# EasyEDA schematic 6502Attempt1.json
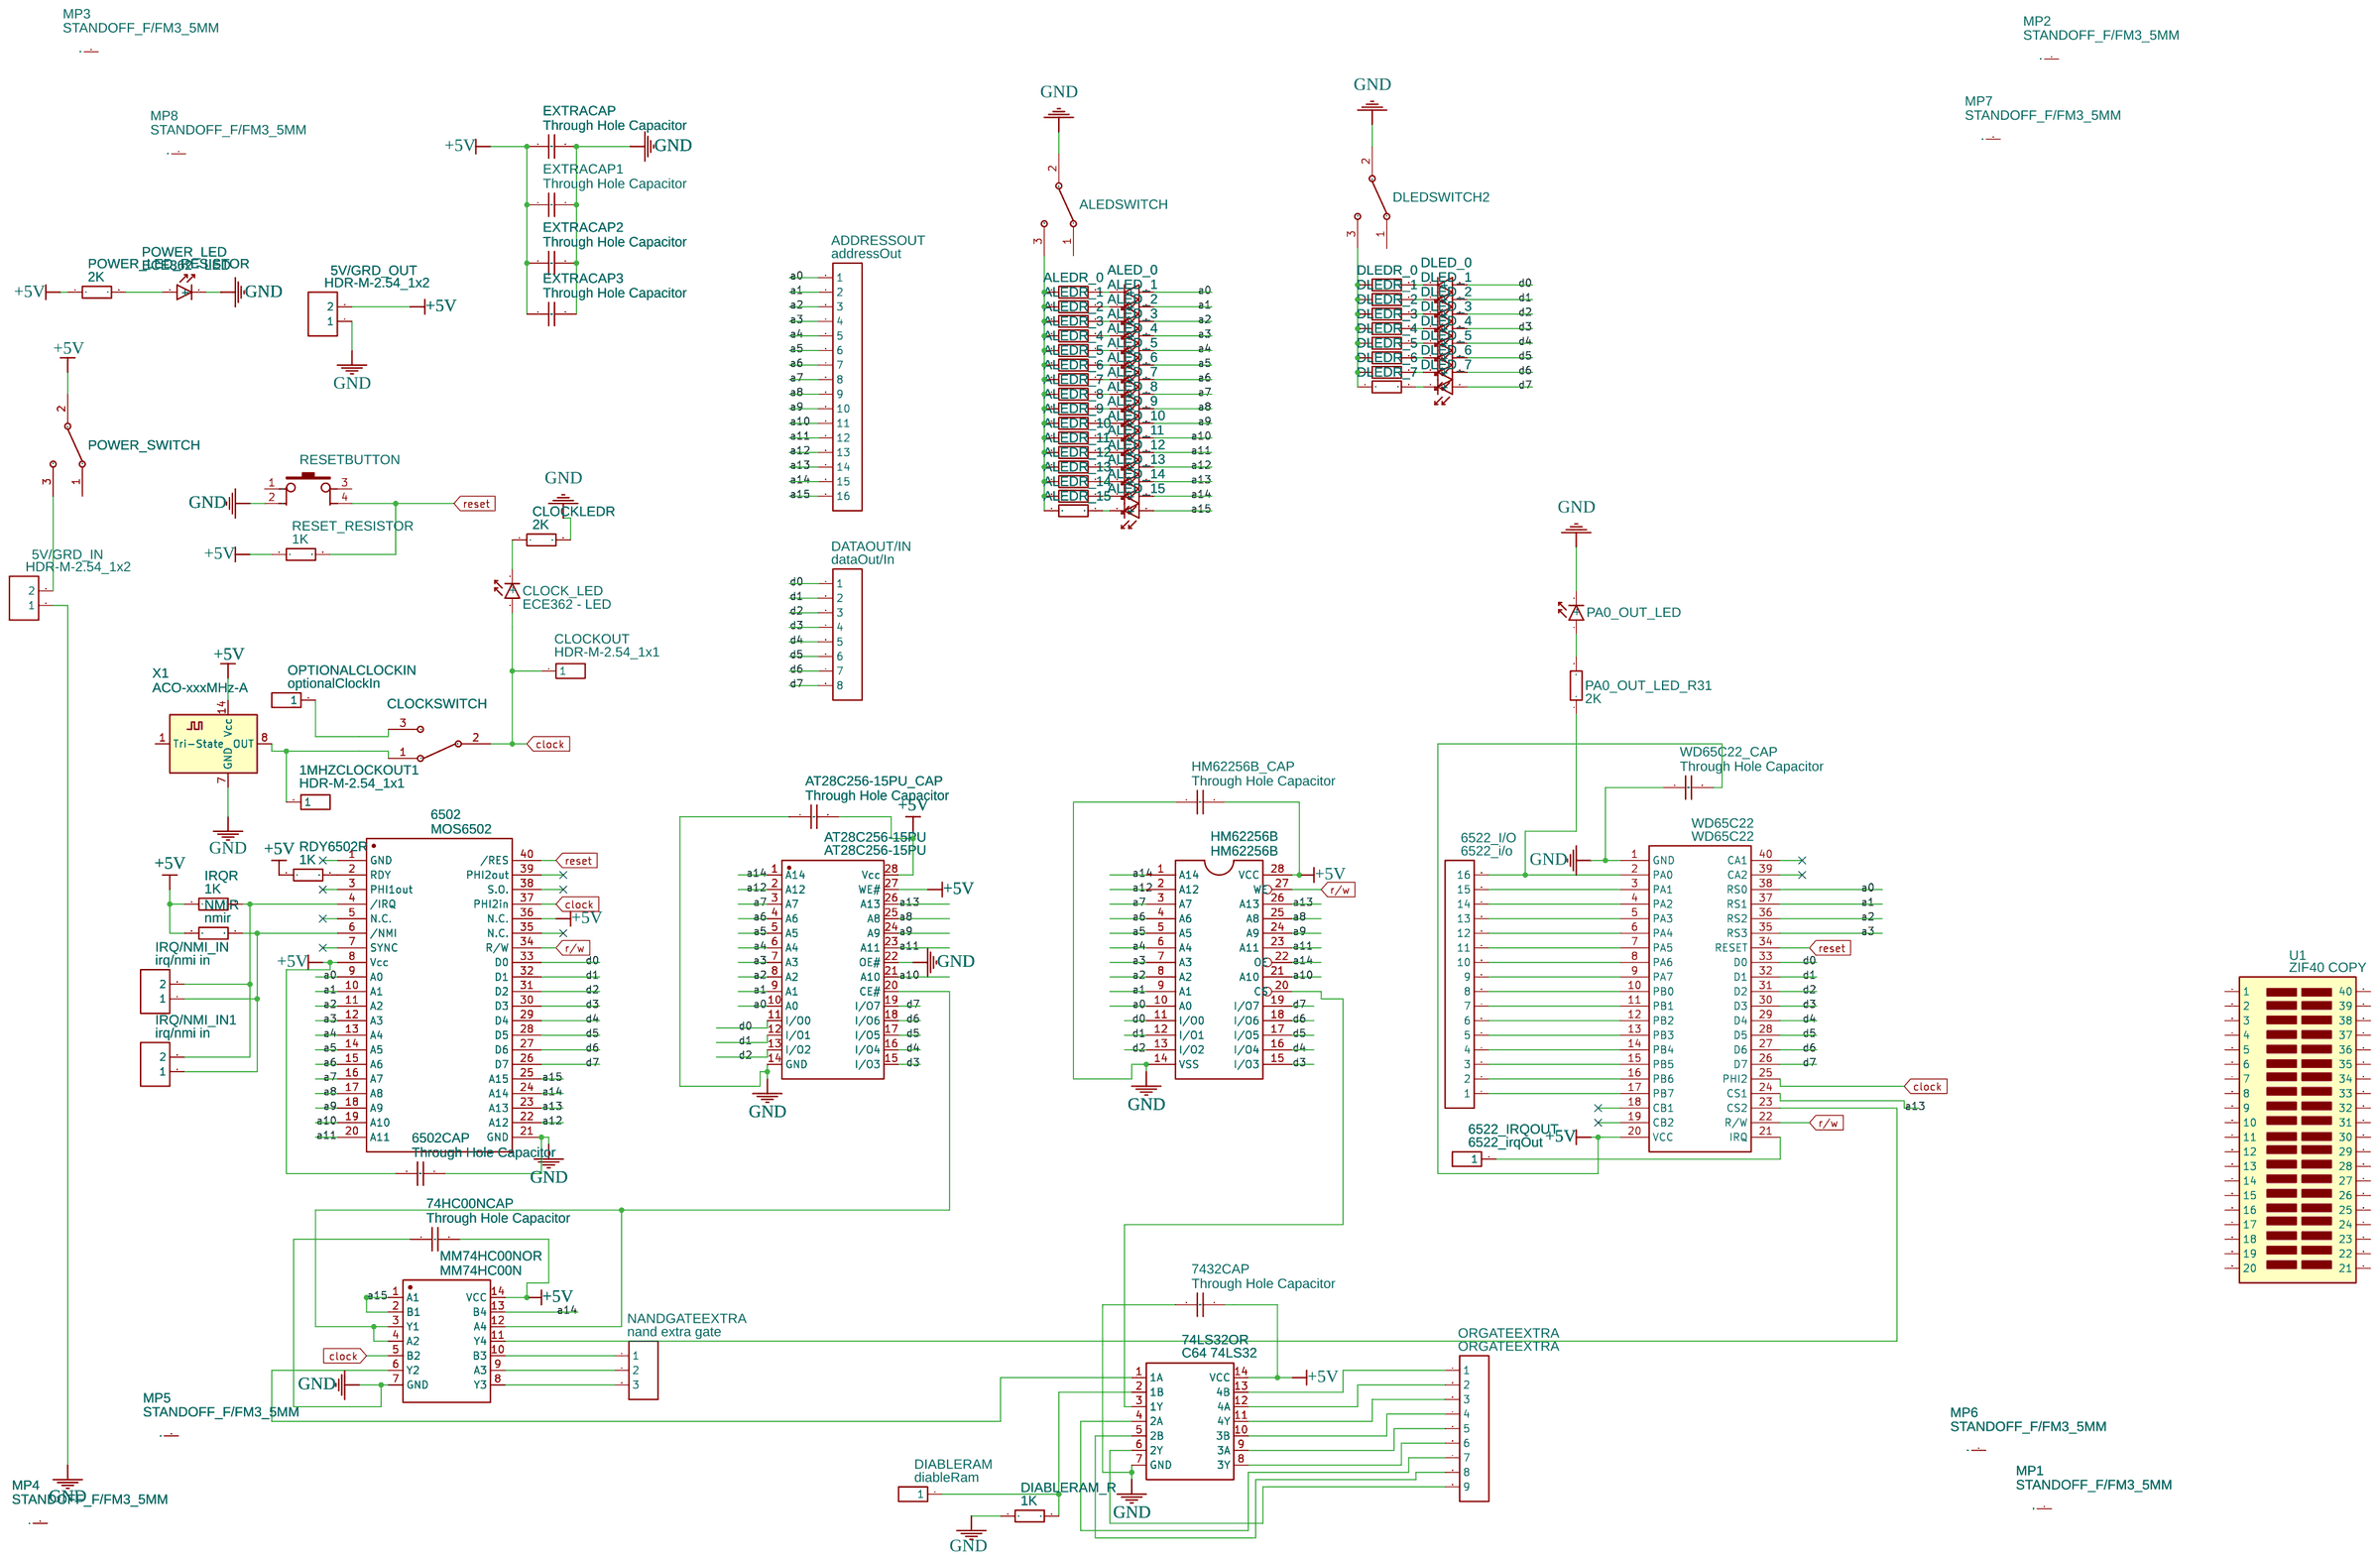
[diagram p0: schematic sheet]

## Parts
1MHZCLOCKOUT1  HDR-M-2.54_1x1  [HDR-M-2.54_1X1]
5V/GRD_IN  HDR-M-2.54_1x2  [HDR-M-2.54_1X2]
5V/GRD_OUT  HDR-M-2.54_1x2  [HDR-M-2.54_1X2]
74HC00NCAP  Through Hole Capacitor  [THROUGH HOLE TANTALUM CAPACITOR]
74LS32OR  C64 74LS32  [C64 74LS32]
6502  MOS6502  [DIP40]
6502CAP  Through Hole Capacitor  [THROUGH HOLE TANTALUM CAPACITOR]
6522_I/O  6522_i/o  [HDR-M-2.54_1X16]
6522_IRQOUT  6522_irqOut  [HDR-M-2.54_1X1]
7432CAP  Through Hole Capacitor  [THROUGH HOLE TANTALUM CAPACITOR]
ADDRESSOUT  addressOut  [HDR-M-2.54_1X16]
ALED_0  ECE362 - LED  [LED-3MM-2.54MM-THROUGH HOLE-FIXED]
ALED_1  ECE362 - LED  [LED-3MM-2.54MM-THROUGH HOLE-FIXED]
ALED_2  ECE362 - LED  [LED-3MM-2.54MM-THROUGH HOLE-FIXED]
ALED_3  ECE362 - LED  [LED-3MM-2.54MM-THROUGH HOLE-FIXED]
ALED_4  ECE362 - LED  [LED-3MM-2.54MM-THROUGH HOLE-FIXED]
ALED_5  ECE362 - LED  [LED-3MM-2.54MM-THROUGH HOLE-FIXED]
ALED_6  ECE362 - LED  [LED-3MM-2.54MM-THROUGH HOLE-FIXED]
ALED_7  ECE362 - LED  [LED-3MM-2.54MM-THROUGH HOLE-FIXED]
ALED_8  ECE362 - LED  [LED-3MM-2.54MM-THROUGH HOLE-FIXED]
ALED_9  ECE362 - LED  [LED-3MM-2.54MM-THROUGH HOLE-FIXED]
ALED_10  ECE362 - LED  [LED-3MM-2.54MM-THROUGH HOLE-FIXED]
ALED_11  ECE362 - LED  [LED-3MM-2.54MM-THROUGH HOLE-FIXED]
ALED_12  ECE362 - LED  [LED-3MM-2.54MM-THROUGH HOLE-FIXED]
ALED_13  ECE362 - LED  [LED-3MM-2.54MM-THROUGH HOLE-FIXED]
ALED_14  ECE362 - LED  [LED-3MM-2.54MM-THROUGH HOLE-FIXED]
ALED_15  ECE362 - LED  [LED-3MM-2.54MM-THROUGH HOLE-FIXED]
ALEDR_0  2K  [GENERIC THROUGH-HOLE RESISTOR]
ALEDR_1  2K  [GENERIC THROUGH-HOLE RESISTOR]
ALEDR_2  2K  [GENERIC THROUGH-HOLE RESISTOR]
ALEDR_3  2K  [GENERIC THROUGH-HOLE RESISTOR]
ALEDR_4  2K  [GENERIC THROUGH-HOLE RESISTOR]
ALEDR_5  2K  [GENERIC THROUGH-HOLE RESISTOR]
ALEDR_6  2K  [GENERIC THROUGH-HOLE RESISTOR]
ALEDR_7  2K  [GENERIC THROUGH-HOLE RESISTOR]
ALEDR_8  2K  [GENERIC THROUGH-HOLE RESISTOR]
ALEDR_9  2K  [GENERIC THROUGH-HOLE RESISTOR]
ALEDR_10  2K  [GENERIC THROUGH-HOLE RESISTOR]
ALEDR_11  2K  [GENERIC THROUGH-HOLE RESISTOR]
ALEDR_12  2K  [GENERIC THROUGH-HOLE RESISTOR]
ALEDR_13  2K  [GENERIC THROUGH-HOLE RESISTOR]
ALEDR_14  2K  [GENERIC THROUGH-HOLE RESISTOR]
ALEDR_15  2K  [GENERIC THROUGH-HOLE RESISTOR]
ALEDSWITCH  Slide Switches_SPDT(Single Pole Double Throw)  [SW-TH_SS-12D01-GX]
AT28C256-15PU  AT28C256-15PU  [PDIP-28_L37.0-W13.5-P2.54-LS15.6-BL]
AT28C256-15PU_CAP  Through Hole Capacitor  [THROUGH HOLE TANTALUM CAPACITOR]
CLOCK_LED  ECE362 - LED  [LED-3MM-2.54MM-THROUGH HOLE-FIXED]
CLOCKLEDR  2K  [GENERIC THROUGH-HOLE RESISTOR]
CLOCKOUT  HDR-M-2.54_1x1  [HDR-M-2.54_1X1]
CLOCKSWITCH  Slide Switches_SPDT(Single Pole Double Throw)  [SW-TH_SS-12D01-GX]
DATAOUT/IN  dataOut/In  [HDR-M-2.54_1X8]
DIABLERAM  diableRam  [HDR-M-2.54_1X1]
DIABLERAM_R  1K  [GENERIC THROUGH-HOLE RESISTOR]
DLED_0  ECE362 - LED  [LED-3MM-2.54MM-THROUGH HOLE-FIXED]
DLED_1  ECE362 - LED  [LED-3MM-2.54MM-THROUGH HOLE-FIXED]
DLED_2  ECE362 - LED  [LED-3MM-2.54MM-THROUGH HOLE-FIXED]
DLED_3  ECE362 - LED  [LED-3MM-2.54MM-THROUGH HOLE-FIXED]
DLED_4  ECE362 - LED  [LED-3MM-2.54MM-THROUGH HOLE-FIXED]
DLED_5  ECE362 - LED  [LED-3MM-2.54MM-THROUGH HOLE-FIXED]
DLED_6  ECE362 - LED  [LED-3MM-2.54MM-THROUGH HOLE-FIXED]
DLED_7  ECE362 - LED  [LED-3MM-2.54MM-THROUGH HOLE-FIXED]
DLEDR_0  2K  [GENERIC THROUGH-HOLE RESISTOR]
DLEDR_1  2K  [GENERIC THROUGH-HOLE RESISTOR]
DLEDR_2  2K  [GENERIC THROUGH-HOLE RESISTOR]
DLEDR_3  2K  [GENERIC THROUGH-HOLE RESISTOR]
DLEDR_4  2K  [GENERIC THROUGH-HOLE RESISTOR]
DLEDR_5  2K  [GENERIC THROUGH-HOLE RESISTOR]
DLEDR_6  2K  [GENERIC THROUGH-HOLE RESISTOR]
DLEDR_7  2K  [GENERIC THROUGH-HOLE RESISTOR]
DLEDSWITCH2  Slide Switches_SPDT(Single Pole Double Throw)  [SW-TH_SS-12D01-GX]
EXTRACAP  Through Hole Capacitor  [THROUGH HOLE TANTALUM CAPACITOR]
EXTRACAP1  Through Hole Capacitor  [THROUGH HOLE TANTALUM CAPACITOR]
EXTRACAP2  Through Hole Capacitor  [THROUGH HOLE TANTALUM CAPACITOR]
EXTRACAP3  Through Hole Capacitor  [THROUGH HOLE TANTALUM CAPACITOR]
HM62256B  HM62256B  [DIL-28]
HM62256B_CAP  Through Hole Capacitor  [THROUGH HOLE TANTALUM CAPACITOR]
IRQ/NMI_IN  irq/nmi in  [HDR-F-2.54_1X2]
IRQ/NMI_IN1  irq/nmi in  [HDR-F-2.54_1X2]
IRQR  1K  [GENERIC THROUGH-HOLE RESISTOR]
MM74HC00NOR  MM74HC00N  [DIP14]
MP1  STANDOFF_F/FM3_5MM  [STANDOFF_HEX_FEMALE_550X500_M3X0.5_MTGP850H320]
MP2  STANDOFF_F/FM3_5MM  [STANDOFF_HEX_FEMALE_550X500_M3X0.5_MTGP850H320]
MP3  STANDOFF_F/FM3_5MM  [STANDOFF_HEX_FEMALE_550X500_M3X0.5_MTGP850H320]
MP4  STANDOFF_F/FM3_5MM  [STANDOFF_HEX_FEMALE_550X500_M3X0.5_MTGP850H320]
MP5  STANDOFF_F/FM3_5MM  [STANDOFF_HEX_FEMALE_550X500_M3X0.5_MTGP850H320]
MP6  STANDOFF_F/FM3_5MM  [STANDOFF_HEX_FEMALE_550X500_M3X0.5_MTGP850H320]
MP7  STANDOFF_F/FM3_5MM  [STANDOFF_HEX_FEMALE_550X500_M3X0.5_MTGP850H320]
MP8  STANDOFF_F/FM3_5MM  [STANDOFF_HEX_FEMALE_550X500_M3X0.5_MTGP850H320]
NANDGATEEXTRA  nand extra gate  [HDR-M-2.54_1X3]
NMIR  nmir  [GENERIC THROUGH-HOLE RESISTOR]
OPTIONALCLOCKIN  optionalClockIn  [HDR-M-2.54_1X1]
ORGATEEXTRA  ORGATEEXTRA  [HDR-M-2.54_1X9]
PA0_OUT_LED  ECE362 - LED  [LED-3MM-2.54MM-THROUGH HOLE-FIXED]
PA0_OUT_LED_R31  2K  [GENERIC THROUGH-HOLE RESISTOR]
POWER_LED  ECE362 - LED  [LED-3MM-2.54MM-THROUGH HOLE-FIXED]
POWER_LED_RESISTOR  2K  [GENERIC THROUGH-HOLE RESISTOR]
POWER_SWITCH  Slide Switches_SPDT(Single Pole Double Throw)  [SW-TH_SS-12D01-GX]
RDY6502R  1K  [GENERIC THROUGH-HOLE RESISTOR]
RESET_RESISTOR  1K  [GENERIC THROUGH-HOLE RESISTOR]
RESETBUTTON  PUSHBUTTON 4PIN (4.5MM*6.1MM) COPY  [PUSHBUTTON 4PIN (4.5MM*6.1MM)]
U1  ZIF40 COPY  [40 PIN ZIF SOCKET]
WD65C22  WD65C22  [DIP-40_L52.0-W13.7-P2.54-LS15.2-BL]
WD65C22_CAP  Through Hole Capacitor  [THROUGH HOLE TANTALUM CAPACITOR]
X1  ACO-xxxMHz-A  [OSCILLATOR_DIP-14]

## Library data of the parts
1MHZCLOCKOUT1 6522_IRQOUT CLOCKOUT DIABLERAM OPTIONALCLOCKIN = HDR-M-2.54_1x1: Supplier Part: C81276; Supplier: LCSC; Contributor: LCEDA_Lib
5V/GRD_IN 5V/GRD_OUT = HDR-M-2.54_1x2: Supplier Part: C124375; Supplier: LCSC; Contributor: LCEDA_Lib
74HC00NCAP 6502CAP 7432CAP AT28C256-15PU_CAP EXTRACAP EXTRACAP1-EXTRACAP3 HM62256B_CAP WD65C22_CAP = Through Hole Capacitor: Manufacturer Part: TAP106K016SCS; Contributor: Felix_95; link: https://www.digikey.ca/scripts/DkSearch/dksus.dll?Detail&itemSeq=258076471&uq=636594837846473767
74LS32OR = C64 74LS32: Contributor: TomPilot
6502 = MOS6502: Contributor: LukasJele
6522_I/O ADDRESSOUT = HDR-M-2.54_1x16: Supplier: LCSC; Contributor: LCEDA_Lib
ALED_0-ALED_15 CLOCK_LED DLED_0-DLED_7 PA0_OUT_LED POWER_LED = ECE362 - LED: Supplier: Mouser; Contributor: victorbramhall
ALEDR_0-ALEDR_15 CLOCKLEDR DIABLERAM_R DLEDR_0-DLEDR_7 IRQR NMIR PA0_OUT_LED_R31 POWER_LED_RESISTOR RDY6502R RESET_RESISTOR = GENERIC THROUGH HOLE RESISTOR 2: Supplier: LCSC; Supplier Part: C348946; Manufacturer: ResistorToday; Manufacturer Part: EWWR0006J10K0T9; Contributor: sanketwalopkar; JLCPCB Part Class: Extended Part; Resistance: 10kΩ
ALEDSWITCH CLOCKSWITCH DLEDSWITCH2 POWER_SWITCH = Slide Switches_SPDT(Single Pole Double Throw): Contributor: banjerdmaising3
AT28C256-15PU = AT28C256-15PU: Supplier: LCSC; Supplier Part: C1348752; Manufacturer: MICROCHIP(美国微芯); Contributor: LCSC; JLCPCB Part Class: Extended Part
DATAOUT/IN = HDR-M-2.54_1x8: Supplier Part: C190820; Supplier: LCSC; Contributor: LCEDA_Lib
HM62256B = HM62256B: Manufacturer: Hitachi; Contributor: andrewkawalec164
IRQ/NMI_IN IRQ/NMI_IN1 = HDR-F-2.54_1x2: Supplier Part: C49661; Supplier: LCSC; Contributor: LCEDA_Lib
MM74HC00NOR = MM74HC00N
MP1-MP8 = STANDOFF_F/FM3_5MM
NANDGATEEXTRA = HDR-M-2.54_1x3: Supplier Part: C180248; Supplier: LCSC; Contributor: LCEDA_Lib
ORGATEEXTRA = HDR-M-2.54_1x9: Supplier Part: C225484; Supplier: LCSC; Contributor: LCEDA_Lib
RESETBUTTON = PUSHBUTTON 4PIN (4.5MM*6.1MM) COPY: Contributor: Sazzad Akhanda
U1 = ZIF40 COPY: Manufacturer Part: New SchematicLib; Contributor: PedroM
WD65C22 = WD65C22: Contributor: 21schemerhornn
X1 = ACO-xxxMHz-A: Contributor: KiCAD; license: https://www.gnu.org/licenses/lgpl-2.1.html

## Nets
+5V: 5V/GRD_OUT.2 74HC00NCAP.2 74LS32OR.14(VCC) 6502.8(Vcc) 6502.36(N.C.) 6502CAP.1 7432CAP.2 AT28C256-15PU.27(WE#) AT28C256-15PU.28(Vcc) AT28C256-15PU_CAP.2 EXTRACAP.1 EXTRACAP1.1 EXTRACAP2.1 EXTRACAP3.1 HM62256B.28(VCC) HM62256B_CAP.2 IRQR.1 MM74HC00NOR.14(VCC) NMIR.1 POWER_LED_RESISTOR.1 POWER_SWITCH.2 RDY6502R.1 RESET_RESISTOR.1 WD65C22.20(VCC) WD65C22_CAP.2 X1.14(Vcc)
GND: 5V/GRD_IN.1 5V/GRD_OUT.1 74HC00NCAP.1 74LS32OR.7(GND) 6502.21(GND) 6502CAP.2 7432CAP.1 ALEDSWITCH.2 AT28C256-15PU.14(GND) AT28C256-15PU.22(OE#) AT28C256-15PU_CAP.1 CLOCKLEDR.2 DIABLERAM_R.1 DLEDSWITCH2.2 EXTRACAP.2 EXTRACAP1.2 EXTRACAP2.2 EXTRACAP3.2 HM62256B.14(VSS) HM62256B_CAP.1 MM74HC00NOR.7(GND) PA0_OUT_LED.2(-) POWER_LED.2(-) RESETBUTTON.2 WD65C22.1(GND) WD65C22_CAP.1 X1.7(GND)
a0: 6502.9(A0) ADDRESSOUT.1 ALED_0.1(+) AT28C256-15PU.10(A0) HM62256B.10(A0) WD65C22.38(RS0)
a1: 6502.10(A1) ADDRESSOUT.2 ALED_1.1(+) AT28C256-15PU.9(A1) HM62256B.9(A1) WD65C22.37(RS1)
a2: 6502.11(A2) ADDRESSOUT.3 ALED_2.1(+) AT28C256-15PU.8(A2) HM62256B.8(A2) WD65C22.36(RS2)
a3: 6502.12(A3) ADDRESSOUT.4 ALED_3.1(+) AT28C256-15PU.7(A3) HM62256B.7(A3) WD65C22.35(RS3)
a4: 6502.13(A4) ADDRESSOUT.5 ALED_4.1(+) AT28C256-15PU.6(A4) HM62256B.6(A4)
a5: 6502.14(A5) ADDRESSOUT.6 ALED_5.1(+) AT28C256-15PU.5(A5) HM62256B.5(A5)
a6: 6502.15(A6) ADDRESSOUT.7 ALED_6.1(+) AT28C256-15PU.4(A6) HM62256B.4(A6)
a7: 6502.16(A7) ADDRESSOUT.8 ALED_7.1(+) AT28C256-15PU.3(A7) HM62256B.3(A7)
a8: 6502.17(A8) ADDRESSOUT.9 ALED_8.1(+) AT28C256-15PU.25(A8) HM62256B.25(A8)
a9: 6502.18(A9) ADDRESSOUT.10 ALED_9.1(+) AT28C256-15PU.24(A9) HM62256B.24(A9)
a10: 6502.19(A10) ADDRESSOUT.11 ALED_10.1(+) AT28C256-15PU.21(A10) HM62256B.21(A10)
a11: 6502.20(A11) ADDRESSOUT.12 ALED_11.1(+) AT28C256-15PU.23(A11) HM62256B.23(A11)
a12: 6502.22(A12) ADDRESSOUT.13 ALED_12.1(+) AT28C256-15PU.2(A12) HM62256B.2(A12)
a13: 6502.23(A13) ADDRESSOUT.14 ALED_13.1(+) AT28C256-15PU.26(A13) HM62256B.26(A13) WD65C22.24(CS1)
a14: 6502.24(A14) ADDRESSOUT.15 ALED_14.1(+) AT28C256-15PU.1(A14) HM62256B.1(A14) HM62256B.22(OE) MM74HC00NOR.13(B4)
a15: 6502.25(A15) ADDRESSOUT.16 ALED_15.1(+) MM74HC00NOR.1(A1) MM74HC00NOR.2(B1)
clock: 6502.37(PHI2in) CLOCK_LED.1(+) CLOCKOUT.1 CLOCKSWITCH.2 MM74HC00NOR.5(B2) WD65C22.25(PHI2)
d0: 6502.33(D0) AT28C256-15PU.11(I/O0) DATAOUT/IN.1 DLED_0.1(+) HM62256B.11(I/O0) WD65C22.33(D0)
d1: 6502.32(D1) AT28C256-15PU.12(I/O1) DATAOUT/IN.2 DLED_1.1(+) HM62256B.12(I/O1) WD65C22.32(D1)
d2: 6502.31(D2) AT28C256-15PU.13(I/O2) DATAOUT/IN.3 DLED_2.1(+) HM62256B.13(I/O2) WD65C22.31(D2)
d3: 6502.30(D3) AT28C256-15PU.15(I/O3) DATAOUT/IN.4 DLED_3.1(+) HM62256B.15(I/O3) WD65C22.30(D3)
d4: 6502.29(D4) AT28C256-15PU.16(I/O4) DATAOUT/IN.5 DLED_4.1(+) HM62256B.16(I/O4) WD65C22.29(D4)
d5: 6502.28(D5) AT28C256-15PU.17(I/O5) DATAOUT/IN.6 DLED_5.1(+) HM62256B.17(I/O5) WD65C22.28(D5)
d6: 6502.27(D6) AT28C256-15PU.18(I/O6) DATAOUT/IN.7 DLED_6.1(+) HM62256B.18(I/O6) WD65C22.27(D6)
d7: 6502.26(D7) AT28C256-15PU.19(I/O7) DATAOUT/IN.8 DLED_7.1(+) HM62256B.19(I/O7) WD65C22.26(D7)
r/w: 6502.34(R/W) HM62256B.27(WE) WD65C22.22(R/W)
reset: 6502.40(/RES) RESET_RESISTOR.2 RESETBUTTON.4 WD65C22.34(RESET)
Net-(1MHZCLOCKOUT1-1): 1MHZCLOCKOUT1.1 CLOCKSWITCH.1 X1.8(OUT)
Net-(5V/GRD_IN-2): 5V/GRD_IN.2 POWER_SWITCH.3
Net-(74LS32OR-1): 74LS32OR.1(1A) MM74HC00NOR.6(Y2)
Net-(74LS32OR-2): 74LS32OR.2(1B) DIABLERAM.1 DIABLERAM_R.2
Net-(74LS32OR-3): 74LS32OR.3(1Y) HM62256B.20(CS)
Net-(74LS32OR-4): 74LS32OR.4(2A) ORGATEEXTRA.7
Net-(74LS32OR-5): 74LS32OR.5(2B) ORGATEEXTRA.8
Net-(74LS32OR-6): 74LS32OR.6(2Y) ORGATEEXTRA.9
Net-(74LS32OR-8): 74LS32OR.8(3Y) ORGATEEXTRA.6
Net-(74LS32OR-9): 74LS32OR.9(3A) ORGATEEXTRA.5
Net-(74LS32OR-10): 74LS32OR.10(3B) ORGATEEXTRA.4
Net-(74LS32OR-11): 74LS32OR.11(4Y) ORGATEEXTRA.3
Net-(74LS32OR-12): 74LS32OR.12(4A) ORGATEEXTRA.2
Net-(74LS32OR-13): 74LS32OR.13(4B) ORGATEEXTRA.1
Net-(6502-2): 6502.2(RDY) RDY6502R.2
Net-(6502-4): 6502.4(/IRQ) IRQ/NMI_IN.2 IRQ/NMI_IN1.2 IRQR.2
Net-(6502-6): 6502.6(/NMI) IRQ/NMI_IN.1 IRQ/NMI_IN1.1 NMIR.2
Net-(6522_I/O-1): 6522_I/O.1 WD65C22.17(PB7)
Net-(6522_I/O-2): 6522_I/O.2 WD65C22.16(PB6)
Net-(6522_I/O-3): 6522_I/O.3 WD65C22.15(PB5)
Net-(6522_I/O-4): 6522_I/O.4 WD65C22.14(PB4)
Net-(6522_I/O-5): 6522_I/O.5 WD65C22.13(PB3)
Net-(6522_I/O-6): 6522_I/O.6 WD65C22.12(PB2)
Net-(6522_I/O-7): 6522_I/O.7 WD65C22.11(PB1)
Net-(6522_I/O-8): 6522_I/O.8 WD65C22.10(PB0)
Net-(6522_I/O-9): 6522_I/O.9 WD65C22.9(PA7)
Net-(6522_I/O-10): 6522_I/O.10 WD65C22.8(PA6)
Net-(6522_I/O-11): 6522_I/O.11 WD65C22.7(PA5)
Net-(6522_I/O-12): 6522_I/O.12 WD65C22.6(PA4)
Net-(6522_I/O-13): 6522_I/O.13 WD65C22.5(PA3)
Net-(6522_I/O-14): 6522_I/O.14 WD65C22.4(PA2)
Net-(6522_I/O-15): 6522_I/O.15 WD65C22.3(PA1)
Net-(6522_I/O-16): 6522_I/O.16 PA0_OUT_LED_R31.1 WD65C22.2(PA0)
Net-(6522_IRQOUT-1): 6522_IRQOUT.1 WD65C22.21(IRQ)
Net-(ALED_0-2): ALED_0.2(-) ALEDR_0.2
Net-(ALED_1-2): ALED_1.2(-) ALEDR_1.2
Net-(ALED_2-2): ALED_2.2(-) ALEDR_2.2
Net-(ALED_3-2): ALED_3.2(-) ALEDR_3.2
Net-(ALED_4-2): ALED_4.2(-) ALEDR_4.2
Net-(ALED_5-2): ALED_5.2(-) ALEDR_5.2
Net-(ALED_6-2): ALED_6.2(-) ALEDR_6.2
Net-(ALED_7-2): ALED_7.2(-) ALEDR_7.2
Net-(ALED_8-2): ALED_8.2(-) ALEDR_8.2
Net-(ALED_9-2): ALED_9.2(-) ALEDR_9.2
Net-(ALED_10-2): ALED_10.2(-) ALEDR_10.2
Net-(ALED_11-2): ALED_11.2(-) ALEDR_11.2
Net-(ALED_12-2): ALED_12.2(-) ALEDR_12.2
Net-(ALED_13-2): ALED_13.2(-) ALEDR_13.2
Net-(ALED_14-2): ALED_14.2(-) ALEDR_14.2
Net-(ALED_15-2): ALED_15.2(-) ALEDR_15.2
Net-(ALEDR_0-1): ALEDR_0.1 ALEDR_1.1 ALEDR_2.1 ALEDR_3.1 ALEDR_4.1 ALEDR_5.1 ALEDR_6.1 ALEDR_7.1 ALEDR_8.1 ALEDR_9.1 ALEDR_10.1 ALEDR_11.1 ALEDR_12.1 ALEDR_13.1 ALEDR_14.1 ALEDR_15.1 ALEDSWITCH.3
Net-(AT28C256-15PU-20): AT28C256-15PU.20(CE#) MM74HC00NOR.3(Y1) MM74HC00NOR.4(A2) MM74HC00NOR.12(A4)
Net-(CLOCK_LED-2): CLOCK_LED.2(-) CLOCKLEDR.1
Net-(CLOCKSWITCH-3): CLOCKSWITCH.3 OPTIONALCLOCKIN.1
Net-(DLED_0-2): DLED_0.2(-) DLEDR_0.2
Net-(DLED_1-2): DLED_1.2(-) DLEDR_1.2
Net-(DLED_2-2): DLED_2.2(-) DLEDR_2.2
Net-(DLED_3-2): DLED_3.2(-) DLEDR_3.2
Net-(DLED_4-2): DLED_4.2(-) DLEDR_4.2
Net-(DLED_5-2): DLED_5.2(-) DLEDR_5.2
Net-(DLED_6-2): DLED_6.2(-) DLEDR_6.2
Net-(DLED_7-2): DLED_7.2(-) DLEDR_7.2
Net-(DLEDR_0-1): DLEDR_0.1 DLEDR_1.1 DLEDR_2.1 DLEDR_3.1 DLEDR_4.1 DLEDR_5.1 DLEDR_6.1 DLEDR_7.1 DLEDSWITCH2.3
Net-(MM74HC00NOR-8): MM74HC00NOR.8(Y3) NANDGATEEXTRA.3
Net-(MM74HC00NOR-9): MM74HC00NOR.9(A3) NANDGATEEXTRA.2
Net-(MM74HC00NOR-10): MM74HC00NOR.10(B3) NANDGATEEXTRA.1
Net-(MM74HC00NOR-11): MM74HC00NOR.11(Y4) WD65C22.23(CS2)
Net-(PA0_OUT_LED-1): PA0_OUT_LED.1(+) PA0_OUT_LED_R31.2
Net-(POWER_LED-1): POWER_LED.1(+) POWER_LED_RESISTOR.2

Not connected (* = marked no-connect by the designer): 6502 1(GND) 3(PHI1out) 5(N.C.) 7(SYNC) 35(N.C.) 38(S.O.) 39(PHI2out); ALEDSWITCH 1; DLEDSWITCH2 1; MP1 1(P$1); MP2 1(P$1); MP3 1(P$1); MP4 1(P$1); MP5 1(P$1); MP6 1(P$1); MP7 1(P$1); MP8 1(P$1); POWER_SWITCH 1; RESETBUTTON 1 3; U1 1 2 3 4 5 6 7 8 9 10 11 12 13 14 15 16 17 18 19 20 21 22 23 24 25 26 27 28 29 30 31 32 33 34 35 36 37 38 39 40; WD65C22 18(CB1) 19(CB2) 39(CA2) 40(CA1); X1 1(Tri-State)
